# Altium schematic sheet 5-Memory.SchDoc
size 431 x 279 mm; Organization: ORGANIZATION; Address1: ADDRESS 1; Address2: ADDRESS 2; Address3: ADDRESS 3; Address4: ADDRESS 4; DocumentNumber: 5; Revision: -; SheetNumber: 5; SheetTotal: 14; ENG_APP_DATE: --/--/--; DSN_APP_DATE: --/--/--; CHK_APP_DATE: --/--/--
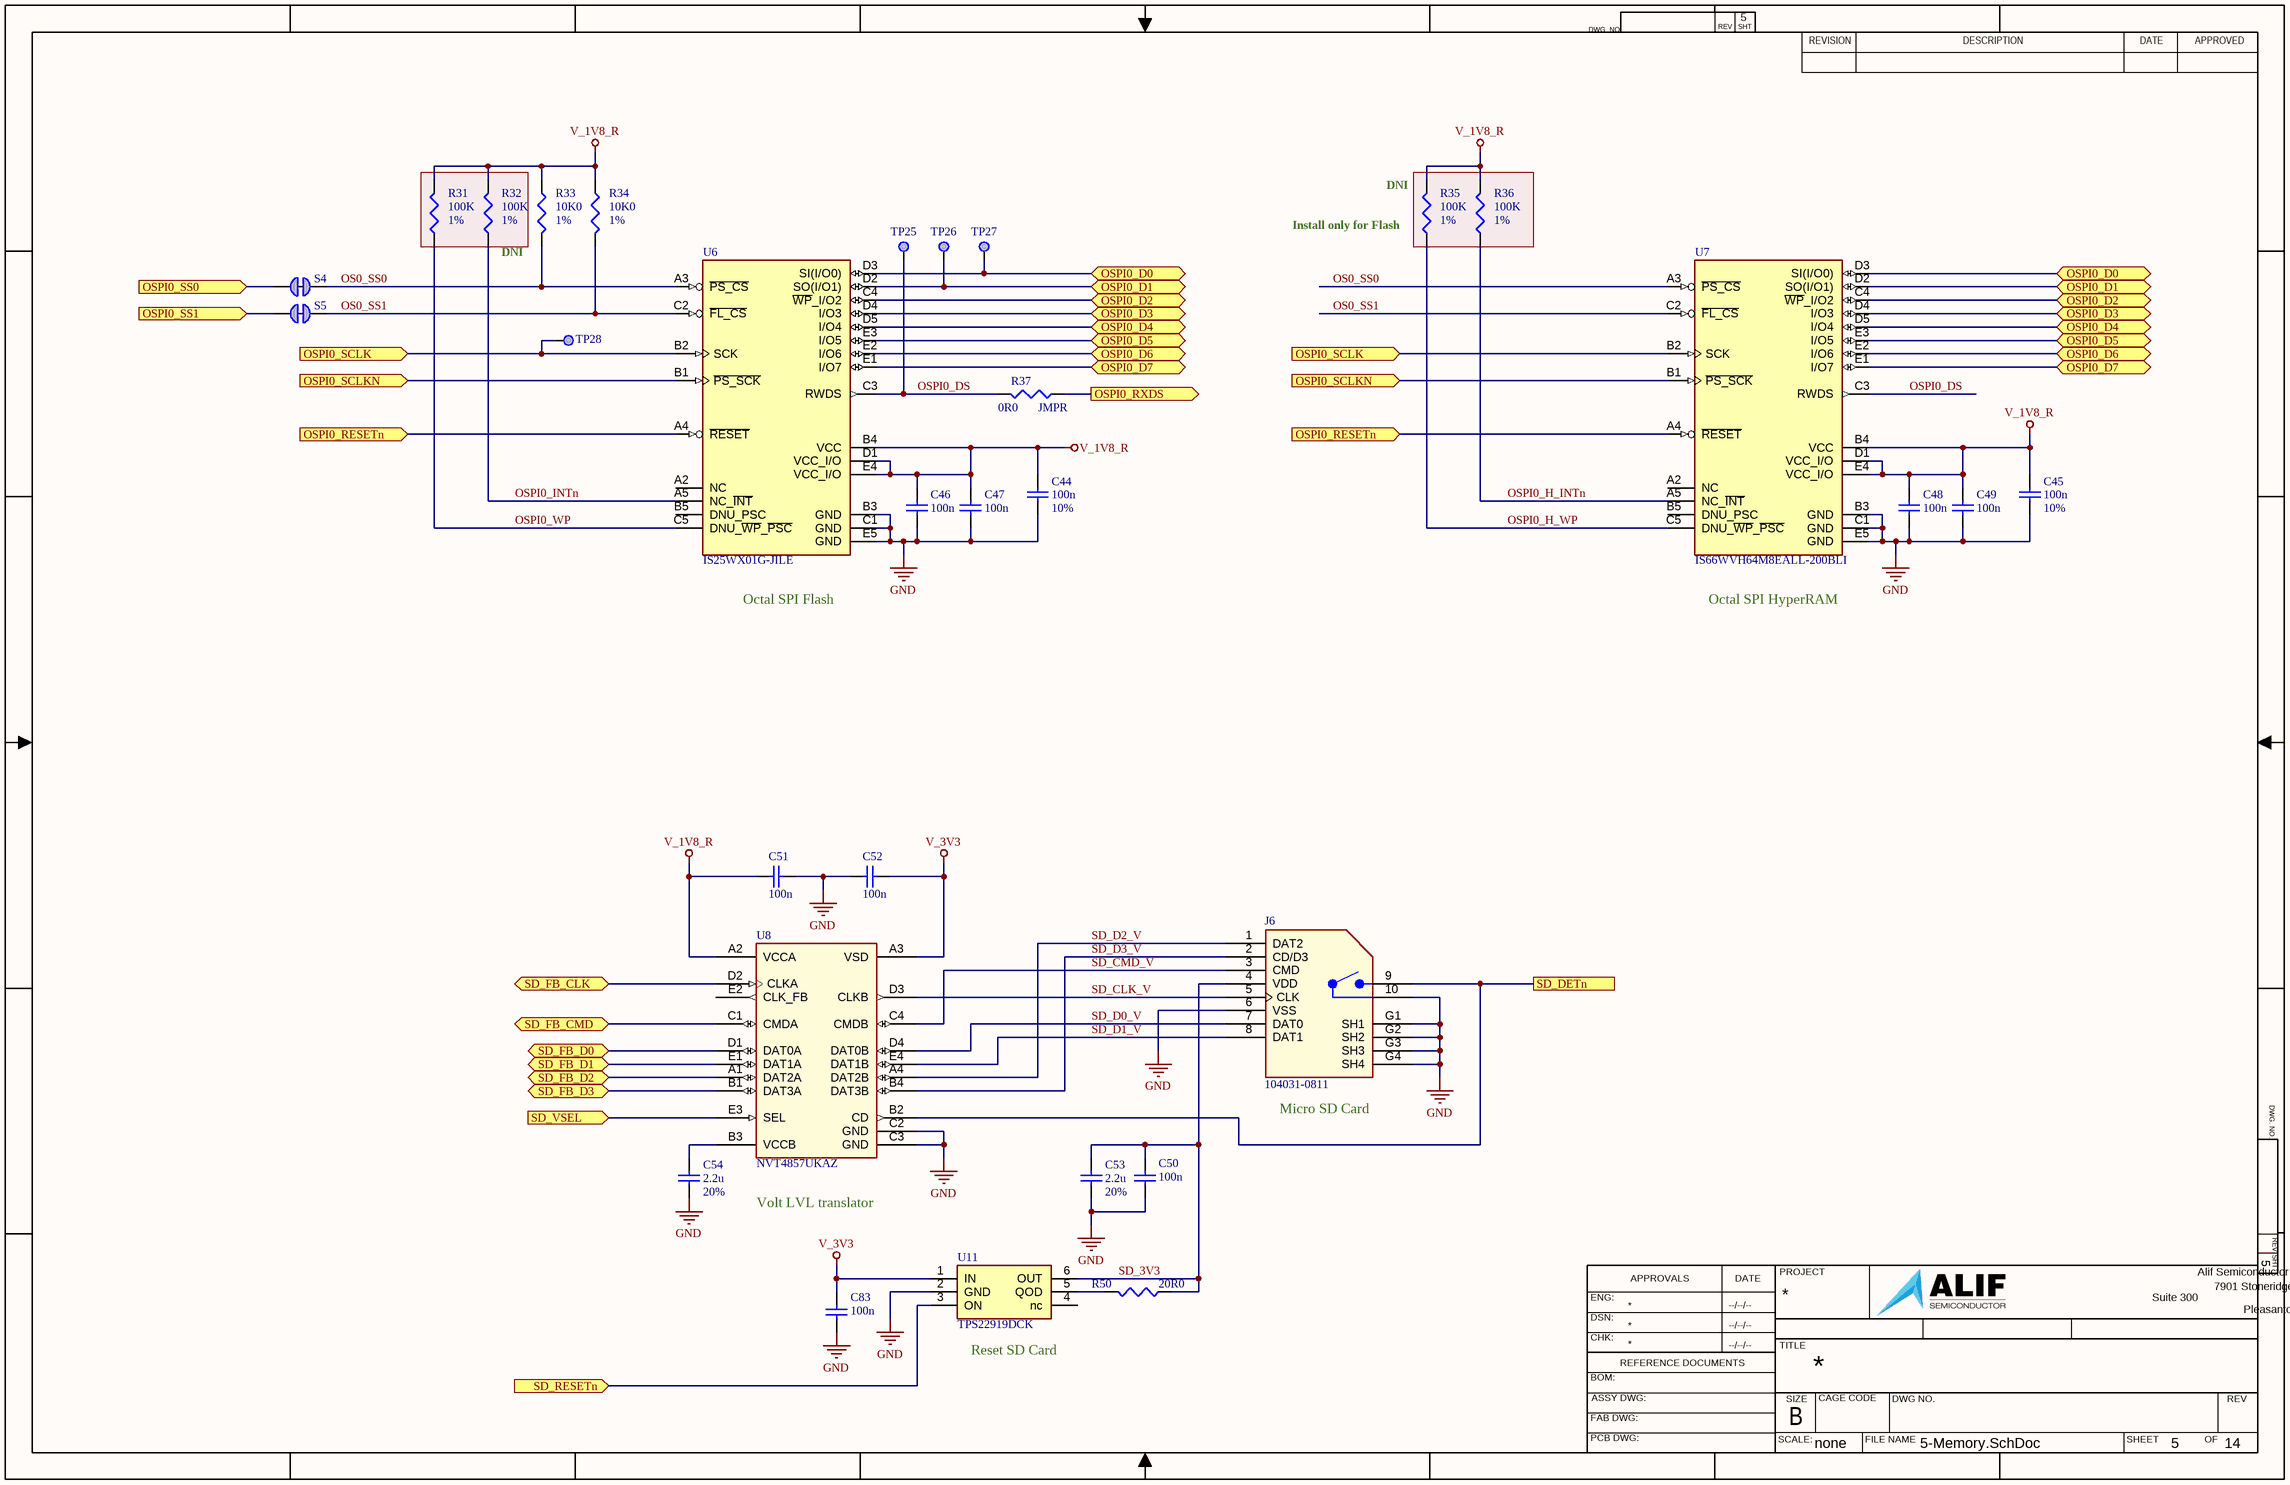
[diagram p0: 5-Memory.SchDoc]

## Parts
C44  value 100n  Tolerance: 10%  [CAPC0402-01]  (hidden comment: Cap)
C45  value 100n  Tolerance: 10%  [CAPC0402-01]  (hidden comment: Cap)
C46  value 100n  [CAPC0402-01]  (hidden comment: Cap)
C47  value 100n  [CAPC0402-01]  (hidden comment: Cap)
C48  value 100n  [CAPC0402-01]  (hidden comment: Cap)
C49  value 100n  [CAPC0402-01]  (hidden comment: Cap)
C50  value 100n  [CAPC0402-01]  (hidden comment: Cap)
C51  value 100n  [CAPC0402-01]  (hidden comment: Cap)
C52  value 100n  [CAPC0402-01]  (hidden comment: Cap)
C53  value 2.2u  Tolerance: 20%  [CAPC0402-01]  (hidden comment: Cap_225M25VX5R0402_1)
C54  value 2.2u  Tolerance: 20%  [CAPC0402-01]  (hidden comment: Cap_225M25VX5R0402_1)
C83  value 100n  [CAPC0402-01]  (hidden comment: Cap)
J6  104031-0811  [CONN_SD_MOLEX_104031-0811]
R31  value 100K  Tolerance: 1%  [RESC0402-01]  (hidden comment: Res3)
R32  value 100K  Tolerance: 1%  [RESC0402-01]  (hidden comment: Res3)
R33  value 10K0  Tolerance: 1%  [RESC0402-01]  (hidden comment: Res3)
R34  value 10K0  Tolerance: 1%  [RESC0402-01]  (hidden comment: Res3)
R35  value 100K  Tolerance: 1%  [RESC0402-01]  (hidden comment: Res3)
R36  value 100K  Tolerance: 1%  [RESC0402-01]  (hidden comment: Res3)
R37  value 0R0  Tolerance: JMPR  [RESC0402-01]  (hidden comment: Res3)
R50  value 20R0  [RESC0402-01]  (hidden comment: Res3)
S4  SolderJumperShorted_Small  [Solderbridge_Shorted]  (value not drawn)  (net tie, no BOM)
S5  SolderJumperShorted_Small  [Solderbridge_Shorted]  (value not drawn)  (net tie, no BOM)
TP25  TP_SMPAD  [TP_30_RND]  (value not drawn)  (no BOM)
TP26  TP_SMPAD  [TP_30_RND]  (value not drawn)  (no BOM)
TP27  TP_SMPAD  [TP_30_RND]  (value not drawn)  (no BOM)
TP28  TP_SMPAD  [TP_30_RND]  (value not drawn)  (no BOM)
U6  Manufacturer Part Number 1: IS25WX01G-JILE  [BGA24C100P5X5_800X600X100N]  (hidden comment: IC_OctalSPI_Generic_1)
U7  Manufacturer Part Number 1: IS66WVH64M8EALL-200BLI  [BGA24C100P5X5_800X600X100N]  (hidden comment: IC_OctalSPI_Generic_1)
U8  NVT4857UKAZ  [WLCSP20_NVT4857_NXP]
U11  TPS22919DCK  [SOT363_DIO]

## Ports
OSPI0_D0 (bidir), OSPI0_D1 (bidir), OSPI0_D2 (bidir), OSPI0_D3 (bidir), OSPI0_D4 (bidir), OSPI0_D5 (bidir), OSPI0_D6 (bidir), OSPI0_D7 (bidir), OSPI0_RESETn (in), OSPI0_RXDS (out), OSPI0_SCLK (in), OSPI0_SCLKN (in), OSPI0_SS0 (in), OSPI0_SS1 (in), SD_DETn, SD_FB_CLK (bidir), SD_FB_CMD (bidir), SD_FB_D0 (bidir), SD_FB_D1 (bidir), SD_FB_D2 (bidir), SD_FB_D3 (bidir), SD_RESETn (in), SD_VSEL (in)

## Nets
GND: C44.1 C45.1 C46.1 C47.1 C48.1 C49.1 C50.1 C51.1 C52.2 C53.1 C54.1 C83.1 J6.6(VSS) J6.10(CD_B) J6.G1(SH1) J6.G2(SH2) J6.G3(SH3) J6.G4(SH4) U6.B3(GND) U6.C1(GND) U6.E5(GND) U7.B3(GND) U7.C1(GND) U7.E5(GND) U8.C2(GND) U8.C3(GND) U11.2(GND)
V_1V8_R: C44.2 C45.2 C46.2 C47.2 C48.2 C49.2 C51.2 R31.2 R32.2 R33.1 R34.1 R35.2 R36.2 U6.B4(VCC) U6.D1(VCC_I/O) U6.E4(VCC_I/O) U7.B4(VCC) U7.D1(VCC_I/O) U7.E4(VCC_I/O) U8.A2(VCCA)
V_3V3: C52.1 C83.2 U8.A3(VSD) U11.1(IN)
OS0_SS0: R33.2 S4.2 U6.A3(~{PS_CS}) U7.A3(~{PS_CS})
OS0_SS1: R34.2 S5.2 U6.C2(~{FL_CS}) U7.C2(~{FL_CS})
OSPI0_D0: TP27.1 U6.D3(SI(I/O0)) U7.D3(SI(I/O0)) ; port OSPI0_D0
OSPI0_D1: TP26.1 U6.D2(SO(I/O1)) U7.D2(SO(I/O1)) ; port OSPI0_D1
OSPI0_D2: U6.C4(~{WP}_I/O2) U7.C4(~{WP}_I/O2) ; port OSPI0_D2
OSPI0_D3: U6.D4(I/O3) U7.D4(I/O3) ; port OSPI0_D3
OSPI0_D4: U6.D5(I/O4) U7.D5(I/O4) ; port OSPI0_D4
OSPI0_D5: U6.E3(I/O5) U7.E3(I/O5) ; port OSPI0_D5
OSPI0_D6: U6.E2(I/O6) U7.E2(I/O6) ; port OSPI0_D6
OSPI0_D7: U6.E1(I/O7) U7.E1(I/O7) ; port OSPI0_D7
OSPI0_DS: R37.2 TP25.1 U6.C3(RWDS) U7.C3(RWDS)
OSPI0_H_INTn: R36.1 U7.A5(NC_~{INT})
OSPI0_H_WP: R35.1 U7.C5(DNU_~{WP}_~{PSC})
OSPI0_INTn: R32.1 U6.A5(NC_~{INT})
OSPI0_RESETn: U6.A4(~{RESET}) U7.A4(~{RESET}) ; port OSPI0_RESETn
OSPI0_RXDS: R37.1 ; port OSPI0_RXDS
OSPI0_SCLK: TP28.1 U6.B2(SCK) U7.B2(SCK) ; port OSPI0_SCLK
OSPI0_SCLKN: U6.B1(~{PS_SCK}) U7.B1(~{PS_SCK}) ; port OSPI0_SCLKN
OSPI0_SS0: S4.1 ; port OSPI0_SS0
OSPI0_SS1: S5.1 ; port OSPI0_SS1
OSPI0_WP: R31.1 U6.C5(DNU_~{WP}_~{PSC})
SD_3V3: C50.2 C53.2 J6.4(VDD) R50.1 U11.6(OUT)
SD_CLK_V: J6.5(CLK) U8.D3(CLKB)
SD_CMD_V: J6.3(CMD) U8.C4(CMDB)
SD_D0_V: J6.7(DAT0) U8.D4(DAT0B)
SD_D1_V: J6.8(DAT1) U8.E4(DAT1B)
SD_D2_V: J6.1(DAT2) U8.A4(DAT2B)
SD_D3_V: J6.2(CD/D3) U8.B4(DAT3B)
SD_DETn: J6.9(CD_A) U8.B2(CD) ; port SD_DETn
SD_FB_CLK: U8.D2(CLKA) ; port SD_FB_CLK
SD_FB_CMD: U8.C1(CMDA) ; port SD_FB_CMD
SD_FB_D0: U8.D1(DAT0A) ; port SD_FB_D0
SD_FB_D1: U8.E1(DAT1A) ; port SD_FB_D1
SD_FB_D2: U8.A1(DAT2A) ; port SD_FB_D2
SD_FB_D3: U8.B1(DAT3A) ; port SD_FB_D3
SD_RESETn: U11.3(ON) ; port SD_RESETn
SD_VSEL: U8.E3(SEL) ; port SD_VSEL
NetC54_2: C54.2 U8.B3(VCCB)
NetR50_2: R50.2 U11.5(QOD)

Not connected (* = marked no-connect by the designer): U6 A2(NC) B5(DNU_PSC); U7 A2(NC) B5(DNU_PSC); U8 E2(CLK_FB); U11 4(nc)

## Notes on the sheet
- (near R35) Install only for Flash
- (near R35) DNI
- DNI
- (near U6) Octal SPI Flash
- (near U7) Octal SPI HyperRAM
- (near J6) Micro SD Card
- Volt LVL translator
- (near U11) Reset SD Card
- DWG. NO.
- REV
- SHT
- REVISION
- DESCRIPTION
- DATE
- APPROVED
- ENG:
- APPROVALS
- PROJECT
- Suite 300
- Alif Semiconductor
- 7901 Stoneridge Drive
- DSN:
- CHK:
- REFERENCE DOCUMENTS
- TITLE
- Pleasanton, CA 94588  USA
- BOM:
- FAB DWG:
- PCB DWG:
- ASSY DWG:
- SCALE:
- SIZE
- B
- CAGE CODE
- FILE NAME
- DWG NO.
- SHEET
- OF
- none

## Library data of the parts
C44-C52 C83 = Cap: Cap,100nF,10%,50V,X7R,0402; Manufacturer 1: TDK; Manufacturer Part Number 1: C1005X7R1H104K050BE; PCB_Footprint: CC0402; Published: 8-Jun-2000; LatestRevisionDate: 17-Jul-2002; LatestRevisionNote: Re-released for DXP Platform.; PackageReference: RAD-0.3; Publisher: Altium Limited; PackageDescription: Radial Cap, Thru-Hole; 2 Leads; 0.3 in Pin Spacing; Max_Height: 0.60mm; Manufacturer 2: Samsung; Manufacturer Part Number 2: CL05B104KB54PNC; Manufacturer 3: Walsin; Manufacturer Part Number 3: 0402B104K500CT; Type: X7R; Voltage: 50V
  C46-C52 C83: Tolerance: 10%
C53 C54 = Cap_225M25VX5R0402_1: Cap,2.2uF,20%,25V,X5R,0402; Manufacturer 1: TDK; Manufacturer Part Number 1: C1005X5R1E225M050BC; PCB_Footprint: CC0402; Published: 8-Jun-2000; LatestRevisionDate: 17-Jul-2002; LatestRevisionNote: Re-released for DXP Platform.; PackageReference: RAD-0.3; Publisher: Altium Limited; PackageDescription: Radial Cap, Thru-Hole; 2 Leads; 0.3 in Pin Spacing; Max_Height: 0.60mm; Type: X5R; Voltage: 25V; Manufacturer 2: Murata; Manufacturer Part Number 2: GRM155R61E225ME11D; Manufacturer 3: Murata; Manufacturer Part Number 3: GRM155R61E225ME15D
J6 = Conn_SD_Molex CN-SD-8-2SW-2S: Conn,Micro SD Card w/ switch, RA, 8-Pin SMD; Voltage Rating: 10VAC/DC; Number of Contacts: 8; Insertion - Extraction Style: Push-Pull; Pitch: 1.1mm; Mating Cycles: 10000; Brand: Molex; Current Rating: 500mA; Manufacturer URL: http://www.molex.com/; Card Type: microSD; Mounting Type: Standard; Height: 1.42mm; Mounting Technology: SurfaceMount; Contact Plating: Gold; Product Category: MemoryCardConnectors; Package Description: 8-Pin Surface Mount Device, Body 11.95 x 11.4 mm, Pitch 1.1 mm; Datasheet URL: http://www.molex.com/pdm_docs/sd/1040310811_sd.pdf; Termination Style: SMD; Length: 11.4mm; Housing Material: LiquidCrystalPolymer(LCP); Orientation: RightAngle; RoHS: True; Contact Material: PhosphorBronze; Datasheet Version: Rev. E, 04/2006; Packaging: Reel; Manufacturer 1: Molex; Manufacturer Part Number 1: 104031-0811; Product: CardConnectors; Number of Rows: 1Row; Package Reference: 104031-0811
R31 R32 R35 R36 = Res3: DNI,Res,100K,1%,100ppm,0402; Manufacturer 1: Stackpol; Manufacturer Part Number 1: RMCF0402FT100K; Wattage: 63mW; Published: 8-Jun-2000; LatestRevisionDate: 29-May-2009; LatestRevisionNote: IPC-7351 Footprint Added.; PackageReference: RESC0402-01; Publisher: Altium Limited; PackageDescription: Chip Resistor; Voltage: *; Type: Thick Film; Manufacturer 2: Yageo; Manufacturer Part Number 2: RC0402FR-07100KL; Manufacturer 3: Bourns; Manufacturer Part Number 3: CR0402-FX-1003GLF; PCB_Footprint: RESC0402-01
R33 R34 = Res3: Res,10K0,1%,100ppm,0402; Manufacturer 1: Stackpol; Manufacturer Part Number 1: RMCF0402FT10K0; Wattage: 63mW; Published: 8-Jun-2000; LatestRevisionDate: 29-May-2009; LatestRevisionNote: IPC-7351 Footprint Added.; PackageReference: RESC0402-01; Publisher: Altium Limited; PackageDescription: Chip Resistor; Voltage: *; Type: Thick Film; Manufacturer 2: Yageo; Manufacturer Part Number 2: RC0402FR-0710KL; Manufacturer 3: Bourns; Manufacturer Part Number 3: CR0402-FX-1002GLF; PCB_Footprint: RESC0402-01
R37 = Res3: Res,0R ohm,Jumper,0402; Manufacturer 1: Stackpol; Manufacturer Part Number 1: RMCF0402ZT0R00; Wattage: 63mW; Published: 8-Jun-2000; LatestRevisionDate: 29-May-2009; LatestRevisionNote: IPC-7351 Footprint Added.; PackageReference: RESC0402-01; Publisher: Altium Limited; PackageDescription: Chip Resistor; Voltage: *; Type: Thick Film; Manufacturer 2: Yageo; Manufacturer Part Number 2: RC0402FR-070RL; Manufacturer 3: Panasonic; Manufacturer Part Number 3: ERJ-XGN0R00Y; PCB_Footprint: RESC0402-01
R50 = Res3: Res,20R0,1%,100ppm,0402; Manufacturer 1: Stackpol; Manufacturer Part Number 1: RMCF0402FT20R; Wattage: 63mW; Published: 8-Jun-2000; LatestRevisionDate: 29-May-2009; LatestRevisionNote: IPC-7351 Footprint Added.; PackageReference: RESC0402-01; Publisher: Altium Limited; PackageDescription: Chip Resistor; Voltage: *; Type: Thick Film; Manufacturer 2: Yageo; Manufacturer Part Number 2: RC0402FR-0720RL; Manufacturer 3: Bourns; Manufacturer Part Number 3: CR0402-FX-20R0GLF; PCB_Footprint: RESC0402-01; Tolerance: 1%
S4 S5 = SolderJumperShorted_Small: DNI,Solderable Jumper,Shorted; Wattage: 63mW; PCB_Footprint: SSHORTED; Published: 8-Jun-2000; LatestRevisionDate: 29-May-2009; LatestRevisionNote: IPC-7351 Footprint Added.; PackageReference: J1-0603; Publisher: Altium Limited; PackageDescription: Chip Resistor; Voltage: *; Type: Thick Film; Manufacturer 1: *; Manufacturer Part Number 1: *; Manufacturer 2: *; Manufacturer Part Number 2: *; Manufacturer 3: *; Manufacturer Part Number 3: *; Tolerance: *; Value: *
TP25-TP28 = TP_SMPAD: Test Point, SMT Pad,--not a BOM item--; PCB_Footprint: TP_PAD1
U6 = IC_OctalSPI_Generic_1: IC, Flash,128MB x 8, Octal SPI, Ind Temp, 1.8V,24-BGA; Manufacturer 1: ISSI; Value: *; Availability: Warning; Price: None; SnapEDA_Link: https://www.snapeda.com/parts/ATXP128-CCUE-Y/Dialog%20Semiconductor/view-part/5488799/?ref=snap; Check_prices: https://www.snapeda.com/parts/ATXP128-CCUE-Y/Dialog%20Semiconductor/view-part/5488799/?ref=eda; MF: *; Purchase-URL: https://pricing.snapeda.com/search/part/ATXP128-CCUE-Y/?ref=eda; Package: BGA-24 Dialog Semiconductor; MP: *; Manufacturer 2: *; Manufacturer Part Number 2: *; Manufacturer 3: *; Manufacturer Part Number 3: *
U7 = IC_OctalSPI_Generic_1: IC, Hyper PSRAM,64MB x 8, Octal SPI, Ind Temp, 1.8V,24-BGA; Manufacturer 1: ISSI; Value: *; Availability: *; Price: *; SnapEDA_Link: *; Check_prices: *; MF: *; Purchase-URL: *; Package: *; MP: *; Manufacturer 2: ISSI; Manufacturer Part Number 2: IS67WVH64M8EALL-200BLA1; Manufacturer 3: ISSI; Manufacturer Part Number 3: IS66WVH64M8EALL-166BLI
U8 = IC_XLAT_NVT4857UK: IC, Voltage Level Translator, 6-bit,push-pull,208Mbps,VCC(A): 1.2V to 1.8V and VCC(B): 1.8V to 3.0V,auto-sense,WLCSP20; Manufacturer 1: NXP; Manufacturer Part Number 1: NVT4857UKAZ; Type: Type; Manufacturer 2: 3Peak; Manufacturer Part Number 2: TPT24857-WS8R-S
U11 = IC_SWIT_TPS22919DCK: IC, Power Switch, Enable, Soft Start, Quick Discharge, 1.6V - 5.5V, 1.5A, SC-70 (SOT-363); Manufacturer 1: TI; Datasheet Link: *; Height: *; Manufacturer Part Number 1: TPS22919DCK; Mouser Part Number: *; Mouser Price/Stock: https://www.mouser.co.uk/ProductDetail/ams/TCS34103M?qs=eP2BKZSCXI7tifzA10IIyw%3D%3D